# EAGLE design mk1 (EAGLE 8.3.1)
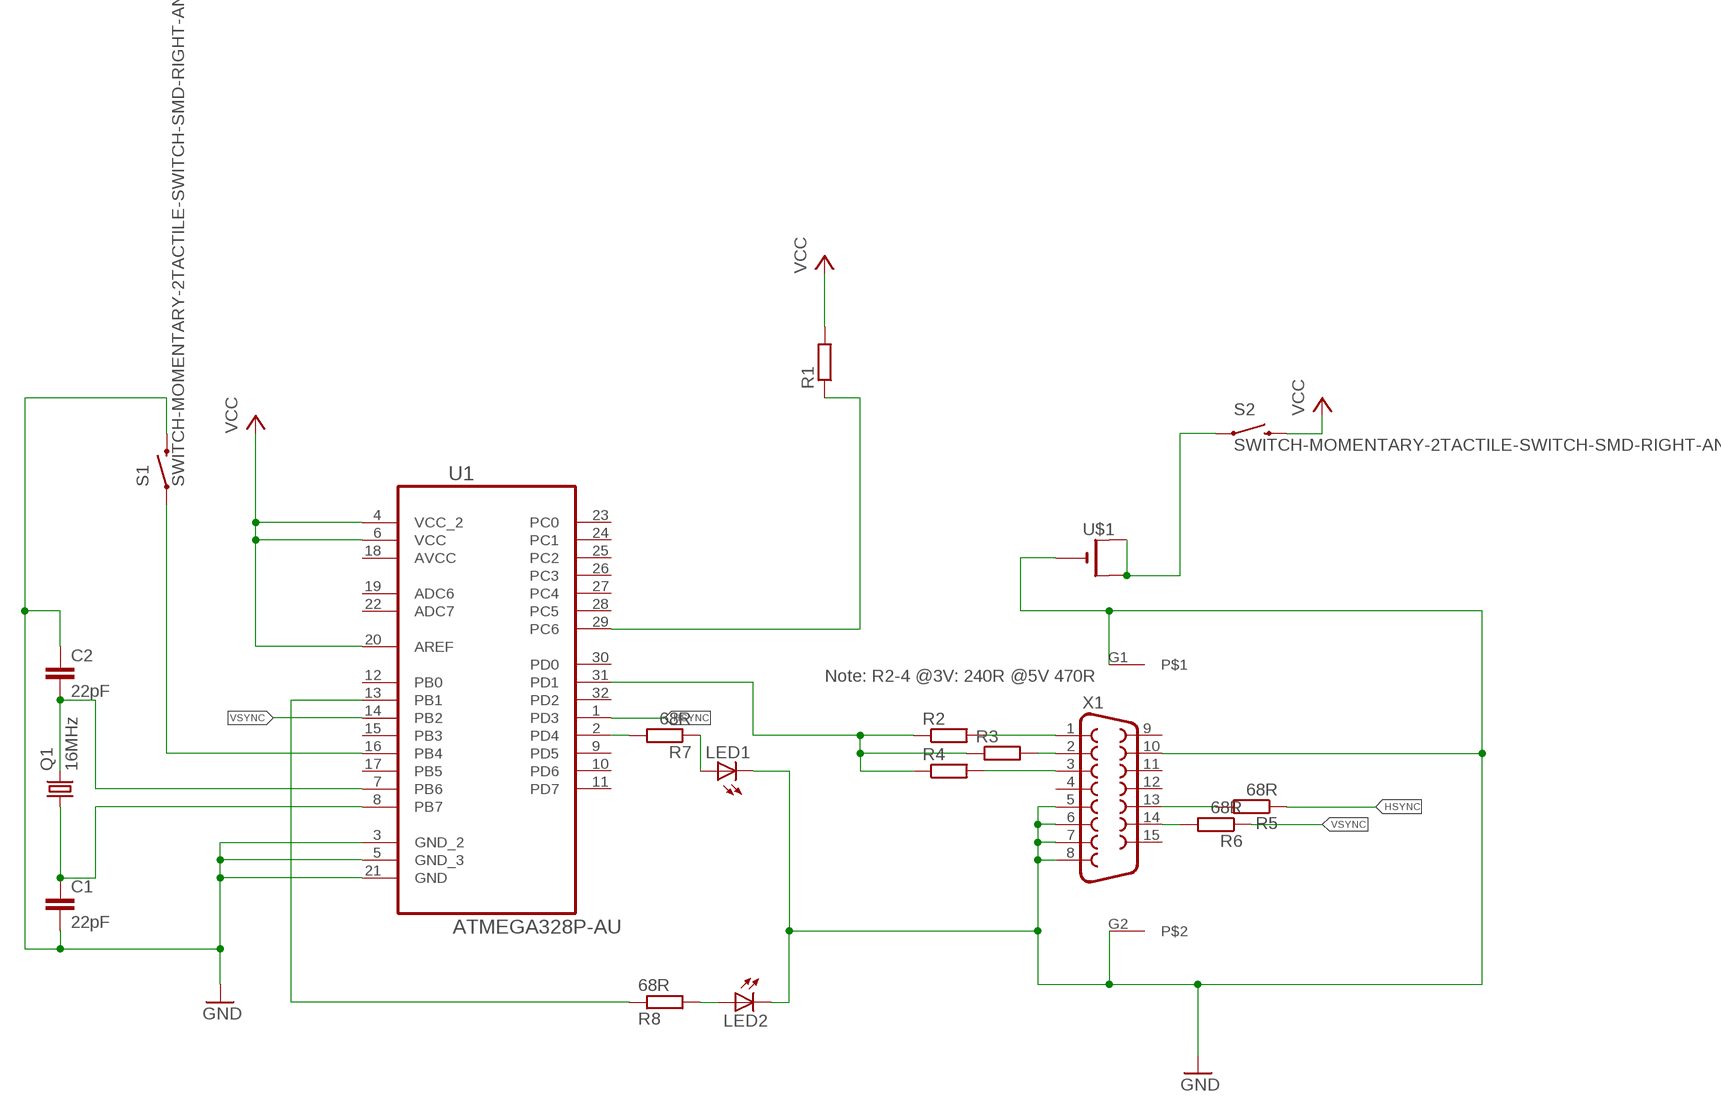
[diagram p0: schematic, sheet 1]

## Parts
C1  22pF  C-EUC1206  [C1206]
C2  22pF  C-EUC1206  [C1206]
LED1  LEDCHIPLED_1206  [CHIPLED_1206]
LED2  LEDCHIPLED_1206  [CHIPLED_1206]
Q1  16MHz  CRYSTALHC49UP  [HC49UP]
R1  R-EU_M1206  [M1206]
R2  R-EU_M1206  [M1206]
R3  R-EU_M1206  [M1206]
R4  R-EU_M1206  [M1206]
R5  68R  R-EU_M1206  [M1206]
R6  68R  R-EU_M1206  [M1206]
R7  68R  R-EU_M1206  [M1206]
R8  68R  R-EU_M1206  [M1206]
S1  SWITCH-MOMENTARY-2TACTILE-SWITCH-SMD-RIGHT-ANGLE  [TACTILE_SWITCH-SMD-RIGHT-ANGLE]
S2  SWITCH-MOMENTARY-2TACTILE-SWITCH-SMD-RIGHT-ANGLE  [TACTILE_SWITCH-SMD-RIGHT-ANGLE]
U1  ATMEGA328P-AU  [QFP80P900X900X120-32N]
U$1  CR2032SMT  [CR2032-SMD]
X1  F15HDV  [HDF15V]

## Nets
GND: C1.2 C2.1 LED1.C LED2.C S1.2 U1.3(GND_2) U1.5(GND_3) U1.21(GND) U$1.- X1.5 X1.6 X1.7 X1.8 X1.10 X1.G1 X1.G2
HSYNC: R5.1 U1.1(PD3)
N$1: R7.2 U1.2(PD4)
N$3: R8.1 U1.13(PB1)
N$4: R2.1 R3.1 R4.1 U1.31(PD1)
N$6: LED1.A R7.1
N$7: LED2.A R8.2
N$8: R2.2 X1.1
N$9: R3.2 X1.2
N$10: R4.2 X1.3
N$11: R6.2 X1.14
N$12: R5.2 X1.13
N$15: S1.1 U1.16(PB4)
PWR: S2.1 U$1.+$1(+) U$1.+$2(+1)
RESET [spec]: R1.1 U1.29(PC6)
VCC: R1.2 S2.2 U1.4(VCC_2) U1.6(VCC) U1.20(AREF)
VSYNC: R6.1 U1.14(PB2)
XTAL1: C1.1 Q1.1 U1.8(PB7)
XTAL2: C2.2 Q1.2 U1.7(PB6)
Unconnected: U1.9(PD5) U1.10(PD6) U1.11(PD7) U1.12(PB0) U1.15(PB3) U1.17(PB5) U1.19(ADC6) U1.22(ADC7) U1.23(PC0) U1.24(PC1) U1.25(PC2) U1.26(PC3) U1.27(PC4) U1.28(PC5) U1.30(PD0) U1.32(PD2) X1.4 X1.9 X1.11 X1.12 X1.15

## Notes on the sheet
- Note: R2-4 @3V: 240R @5V 470R

## Power pins joined to a net without a drawn wire
AVCC: U1.18(AVCC)

## Library data of the parts
C1 C2 = resistor:C-EU: CAPACITOR, European symbol
LED1 LED2 = adafruit:LED: LED OSRAM: - CHIPLED LG R971, LG N971, LY N971, LG Q971, LY Q971, LO R971, LY R971 LH N974, LH R974 LS Q976, LO Q976, LY Q976 LO Q996 - Hyper CHIPLED LW Q18S LB Q993, LB Q99A, LB R99A - SideLED LS A670, LO A670, LY A670, LG A670, LP A670 LB A673, LV A673, LT A673, LW A673 LH A674 LY A675 LS A676, LA A676, LO A676, LY A676, LW A676 LS A679, LY A679, LG A679 - Hyper Micro SIDELED® LS Y876, LA Y876, LO Y876, LY Y876 LT Y87S - SmartLED LW L88C, LW L88S LB L89C, LB L89S, LG L890 LS L89K, LO L89K, LY L89K LS L896, LA L896, LO L896, LY L896 - TOPLED LS T670, LO T670, LY T670, LG T670, LP T670 LSG T670, LSP T670, LSY T670, LOP T670, LYG T670 LG T671, LOG T671, LSG T671 LB T673, LV T673, LT T673, LW T673 LH T674 LS T676, LA T676, LO T676, LY T676, LB T676, LH T676, LSB T676, LW T676 LB T67C, LV T67C, LT T67C, LS T67K, LO T67K, LY T67K, LW E67C LS E67B, LA E67B, LO E67B, LY E67B, LB E67C, LV E67C, LT E67C LW T67C LS T679, LY T679, LG T679 LS T770, LO T770, LY T770, LG T770, LP T770 LB T773, LV T773, LT T773, LW T773 LH T774 LS E675, LA E675, LY E675, LS T675 LS T776, LA T776, LO T776, LY T776, LB T776 LHGB T686 LT T68C, LB T68C - Hyper Mini TOPLED® LB M676 - Mini TOPLED Santana® LG M470 LS M47K, LO M47K, LY M47K Source: http://www.osram.convergy.de/
Q1 = adafruit:CRYSTAL: CRYSTAL; OC_FARNELL: unknown; OC_NEWARK: unknown
R1-R8 = resistor:R-EU_: RESISTOR, European symbol
S1 S2 = SparkFun-Electromechanical:SWITCH-MOMENTARY-2: Various NO switches- pushbuttons, reed, etc; PROD_ID: COMP-12265
U1 = Atmel_By_element14_Batch_1-00:ATMEGA328P-AU: 8-bit Microcontroller with In-System Programmable Flash; MPN: ATMEGA328P-AU; OC_FARNELL: 1715486; OC_NEWARK: 14R4631; PACKAGE: TQFP-32; SUPPLIER: Atmel
U$1 = adafruit:CR2032
X1 = adafruit:F15: SUB-D HDH is also known as a 'right angle VGA' connector

## Net classes
0 default: width 0.254 mm, clearance 0.152 mm
1 spec: width 0.152 mm

## Board
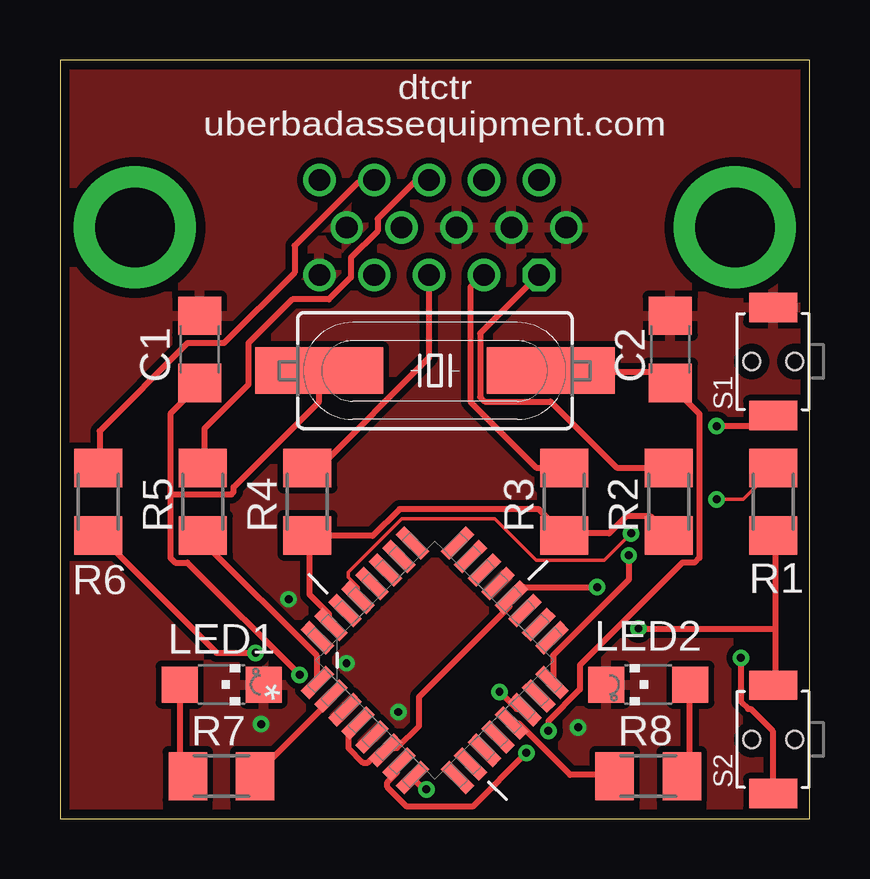
[diagram p1: board, top side]
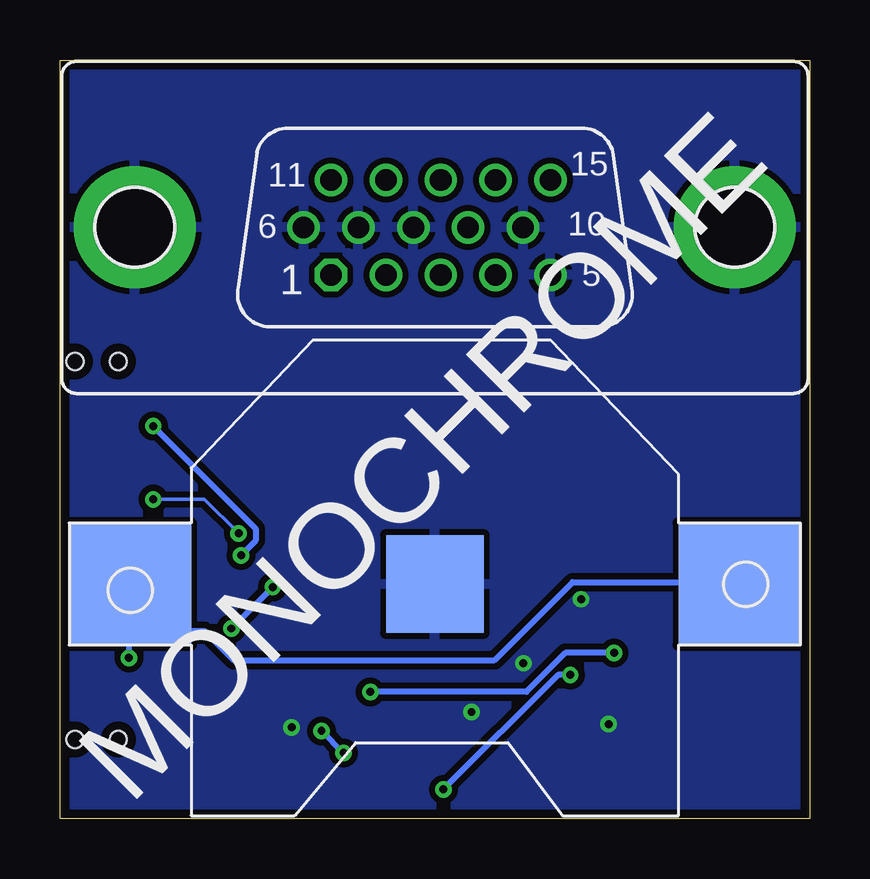
[diagram p2: board, bottom side, seen from below]

Size 31.24 x 31.61 mm. Coordinates in mm from the lower left corner, seen from the top.
Outline: 0,0 31.24,0 31.24,31.61 0,31.61 0,0
Copper layers (1*16): Top 0.0356mm / dielectric 1.5011mm / Bottom 0.0356mm
Design rules "LaenPCBOrder *": minimum track width 6mil, minimum drill 13mil, track to track 6mil, track to pad 6mil, pad to pad 6mil, via to via 6mil, smd to smd 6mil, copper to edge 15mil, drill to drill 6mil, minimum pad ring 7mil, minimum via ring 7mil, stop-mask expansion 3mil, vias tented up to drill 13mil, thermal gap 10mil

### Footprints (pad centres in the part's own frame; a part is rotated, then mirrored left to right if it is on the bottom)
C1206 = smd 1.6 x 1.8: 1 -1.4,0; 2 1.4,0
CHIPLED_1206 = smd 1.5 x 1.5: A 0,-1.75; C 0,1.75
HC49UP = smd 5.334 x 1.93: 1 -4.826,0; 2 4.826,0
M1206 = smd 1.6 x 2: 1 -1.4,0; 2 1.4,0
TACTILE_SWITCH-SMD-RIGHT-ANGLE = smd 1.219 x 2: 1 -2.255,0; 2 2.255,0 | hole 0.7: 0,0.9; 0,-0.9
QFP80P900X900X120-32N = smd 1.473 x 0.508: 1 -4.115,2.794; 2 -4.115,2.007; 3 -4.115,1.194; 4 -4.115,0.406; 5 -4.115,-0.406; 6 -4.115,-1.194; 7 -4.115,-2.007; 8 -4.115,-2.794; 17 4.115,-2.794; 18 4.115,-2.007; 19 4.115,-1.194; 20 4.115,-0.406; 21 4.115,0.406; 22 4.115,1.194; 23 4.115,2.007; 24 4.115,2.794 | smd 0.508 x 1.473: 9 -2.794,-4.115; 10 -2.007,-4.115; 11 -1.194,-4.115; 12 -0.406,-4.115; 13 0.406,-4.115; 14 1.194,-4.115; 15 2.007,-4.115; 16 2.794,-4.115; 25 2.794,4.115; 26 2.007,4.115; 27 1.194,4.115; 28 0.406,4.115; 29 -0.406,4.115; 30 -1.194,4.115; 31 -2.007,4.115; 32 -2.794,4.115
CR2032-SMD = smd 5.08 x 5.08: +$1 -12.7,0; +$2 12.7,0 | smd 4.064 x 4.064: - 0,0
HDF15V = drill 0.9 octagon: 1 4.329,1.98 | drill 0.9: 2 2.043,1.98; 3 -0.243,1.98; 4 -2.529,1.98; 5 -4.815,1.98; 6 5.472,0; 7 3.186,0; 8 0.9,0; 9 -1.386,0; 10 -3.672,0; 11 4.329,-1.98; 12 2.043,-1.98; 13 -0.243,-1.98; 14 -2.529,-1.98; 15 -4.815,-1.98 | drill 3.302 pad 5.08: G1 -12.5,0; G2 12.5,0

### Placement (x,y rotation side)
C1  5.82,19.56 90 top
C2  25.43,19.56 270 top
LED1  6.73,5.59 270 top
LED2  24.51,5.59 90 top
Q1  15.62,18.67 0 top
R1  29.72,13.21 270 top
R2  25.36,13.21 90 top
R3  21.01,13.21 90 top
R4  10.3,13.21 90 top
R5  5.95,13.21 90 top
R6  1.6,13.21 90 top
R7  6.73,1.78 0 top
R8  24.51,1.78 0 top
S1  29.72,19.05 90 top
S2  29.72,3.3 90 top
U1  15.62,6.6 45 top
U$1  15.62,9.78 180 bottom
X1  15.62,24.64 180 bottom

### Tracks (layer width: path | path; a pad name or v marks a point on that pad's centre or on a via)
GND  (via drill 0.33)
  other vias: 9.53,9.14 8.38,3.94 21.59,3.81 14.1,4.45 11.94,6.48
  pour Bottom (isolate 0.254): -0.89,32.26 32.13,32.26 32.13,-0.76 -0.89,-0.76
  pour Top (isolate 0.254): 0.38,32.26 32.13,32.26 32.13,-0.76 -0.89,-0.76 -0.89,32.26
HSYNC
  Top 0.254: U1.1 10.69,5.69 10.69,6.81 6.02,11.48 6.02,11.79 R5.1
N$1
  Top 0.254: U1.2 11.2,5.08 11.2,4.88 8.15,1.83 R7.2
N$3
  Top 0.254: U1.13 18.82,3.96 19.13,3.96 21.26,1.83 23.09,1.83 R8.1
N$4
  Top 0.254: U1.31 11.2,8.13 11.2,8.53 10.39,9.35 10.39,11.79 R4.1 10.49,11.79 13.03,11.79 14.15,12.9 19.94,12.9 20.96,11.89 R3.1 21.06,11.89 22.89,11.89 23.6,12.6 24.61,12.6 25.32,11.89 R2.1
N$6
  Top 0.254: LED1.A 5,5.59 5,2.13 5.31,1.83 R7.1
N$7
  Top 0.254: LED2.A 26.24,5.59 26.24,2.13 25.93,1.83 R8.2
N$8
  Top 0.254: R2.2 25.32,14.63 23.19,14.63 20.45,17.37 17.7,17.37 17.5,17.58 17.5,20.22 19.94,22.66 X1.1
N$9
  Top 0.254: R3.2 20.96,14.63 19.84,14.63 17.09,17.37 17.09,22.15 17.6,22.66 X1.2
N$10
  Top 0.254: R4.2 10.39,14.63 10.79,14.63 15.37,19.2 15.37,22.66 X1.3
N$11
  Top 0.254: R6.2 1.65,14.63 1.65,16.15 5.31,19.81 6.83,19.81 9.78,22.76 9.78,23.88 12.42,26.52 13.03,26.52 X1.14
N$12
  Top 0.254: R5.2 6.02,14.63 6.02,16.26 7.85,18.09 7.85,19.81 9.68,21.64 11.2,21.64 12.12,22.55 12.12,23.37 13.23,24.49 13.23,24.99 14.76,26.52 15.37,26.52 X1.13
N$15  (via drill 0.33)
  Top 0.254: v23.7,10.97 23.7,9.96 20.55,6.81 20.55,5.69 U1.16 | v27.36,16.36 29.29,16.36 29.69,16.76 S1.1
  Bottom 0.254: v23.7,10.97 23.09,11.58 23.09,12.09 v27.36,16.36
PWR  (via drill 0.33)
  Top 0.254: v28.37,6.71 28.37,4.88 28.68,4.57 28.78,4.57 29.69,3.66 29.69,1.12 S2.1
  Bottom 0.254: v28.37,6.71 28.37,9.75 U$1.+$2 28.27,7.82 25.22,7.82 24,6.6 13.13,6.6 9.88,9.86 2.97,9.86 U$1.+$1
RESET  (via drill 0.33)
  Top 0.152: v23.8,11.89 22.68,10.77 19.84,10.77 18.11,12.5 14.25,12.5 12.01,10.26 12.01,10.06 12.42,9.65 12.42,9.25 U1.29 | v27.36,13.31 28.47,13.31 29.69,14.53 R1.1
  Bottom 0.152: v23.8,11.89 25.22,13.31 v27.36,13.31
VCC  (via drill 0.33)
  Top 0.254: 29.79,7.93 29.79,11.79 R1.2 | 29.79,7.93 29.79,5.59 S2.2 | U1.4 12.42,3.96 12.01,3.56 12.01,2.95 12.62,2.34 12.83,2.34 13.34,2.84 13.54,2.84 U1.6 13.64,2.95 14.05,2.95 14.96,3.86 14.96,5.08 18.72,8.84 18.72,9.14 U1.20 18.92,9.25 19.33,9.65 v22.38,9.65 | v24.11,7.93 29.79,7.93
  Bottom 0.254: v22.38,9.65 v24.11,7.93
VSYNC  (via drill 0.33)
  Top 0.254: v18.31,5.28 19.03,4.57 19.33,4.57 U1.14 | v8.15,6.91 6.53,6.91 1.65,11.79 R6.1
  Bottom 0.254: v18.31,5.28 11.81,5.28 10.19,6.91 v8.15,6.91
XTAL1  (via drill 0.33)
  Top 0.254: v15.27,1.22 15.16,1.22 14.76,1.63 U1.8 | v9.98,5.99 5.31,10.67 4.8,10.67 4.6,10.87 4.6,13.51 | 4.6,13.51 4.6,16.87 5.82,18.09 C1.1 | Q1.1 10.79,17.37 7.24,13.82 7.24,13.61 7.14,13.51 4.6,13.51
  Bottom 0.254: v15.27,1.22 10.49,5.99 v9.98,5.99
XTAL2  (via drill 0.33)
  Top 0.254: v19.43,2.74 17.2,0.51 14.45,0.51 13.64,1.32 13.64,1.52 14.05,1.93 14.05,2.24 U1.7 | v20.35,3.66 20.35,4.06 21.67,5.38 21.67,6.4 25.93,10.67 26.44,10.67 26.64,10.87 26.64,16.87 25.43,18.09 C2.2 25.32,18.19 24.92,18.59 20.45,18.59 Q1.2
  Bottom 0.254: v20.35,3.66 v19.43,2.74

### Text on the board
tPlace: dtctr / uberbadassequipment.com
bPlace: MONOCHROME
tDocu: This is the MONOCHROME version!